# Altium schematic sheet aKaReZa75_eBoard_STM32F103C8__STM32F103C8__USBtoTTL.SchDoc: USBtoTTL
size A4; SheetNumber: 4; SheetTotal: 4
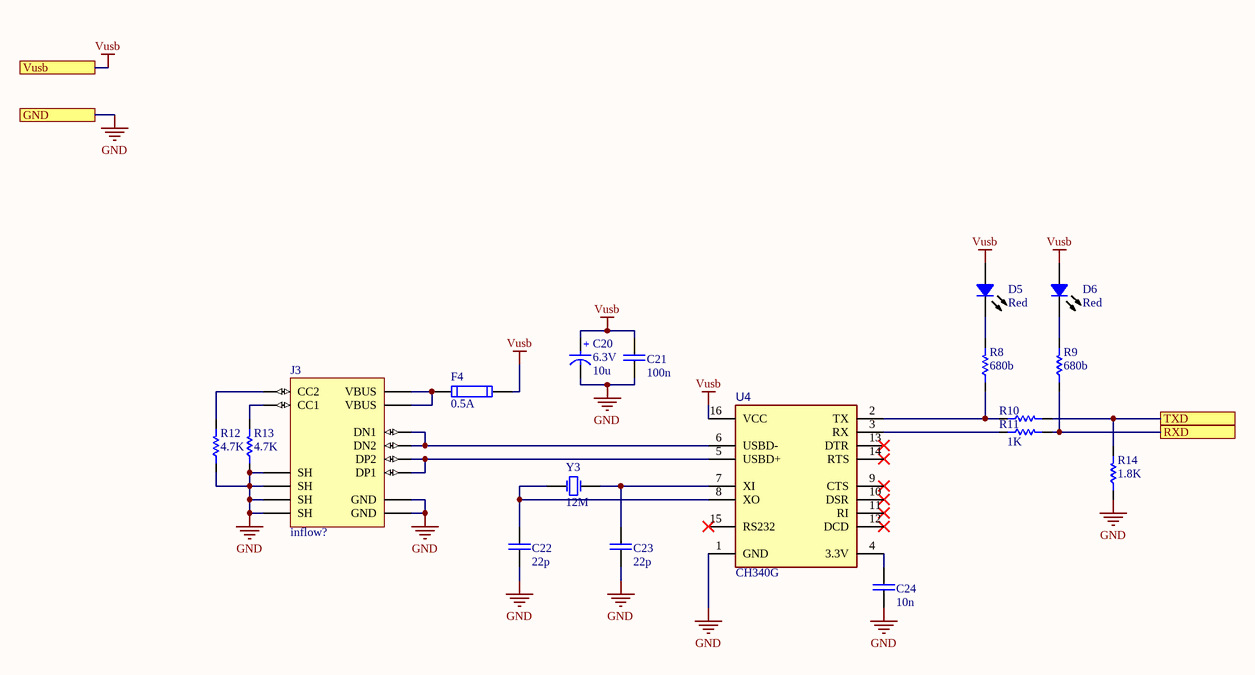
[diagram p0: aKaReZa75_eBoard_STM32F103C8__STM32F103C8__USBtoTTL.SchDoc]

## Parts
C20  Rating: 6.3V  [SMT_C_Tantalum_A]  (hidden comment: 10u)
C21  100n  [CAP 0805/2012]
C22  22p  [CAP 0805/2012]
C23  22p  [CAP 0805/2012]
C24  10n  [CAP 0805/2012]
D5  Red  [LED 0805/2012 RED]
D6  Red  [LED 0805/2012 RED]
F4  0.5A  [1206_F]
J3  Inflow: inflow?  [HRO_TYPE-C-31-M-12 - Extended]  (hidden comment: 12b)
R8  680b  [RES 0805 (2012X06L)]
R9  680b  [RES 0805 (2012X06L)]
R10  1K  [RES 0805 (2012X06L)]  (value not drawn)
R11  1K  [RES 0805 (2012X06L)]
R12  4.7K  [RES 0805 (2012X06L)]
R13  4.7K  [RES 0805 (2012X06L)]
R14  1.8K  [RES 0805 (2012X06L)]
U4  CH340G  [SO16_M]
Y3  12M  [Crystal SMD]

## Ports
GND, RXD, TXD, Vusb

## Nets
GND: C20.2(-) C21.2 C22.2 C23.2 C24.2 J3.A1_B12(GND) J3.B1_A12(GND) J3.S1(SH) J3.S2(SH) J3.S3(SH) J3.S4(SH) R12.1 R13.1 R14.1 U4.1(GND) ; port GND
Vusb: C20.1(+) C21.1 D5.1 D6.1 F4.2 U4.16(VCC) ; port Vusb
RXD: R9.1 R11.2 ; port RXD
TXD: R10.2 R14.2 ; port TXD
NetC22_1: C22.1 U4.8(XO) Y3.1(OSC1)
NetC23_1: C23.1 U4.7(XI) Y3.2(OSC2)
NetC24_1: C24.1 U4.4(3.3V)
NetD5_2: D5.2 R8.2
NetD6_2: D6.2 R9.2
NetF4_1: F4.1 J3.A4_B9(VBUS) J3.B4_A9(VBUS)
NetJ3_A5: J3.A5(CC1) R13.2
NetJ3_A6: J3.A6(DP1) J3.B6(DP2) U4.5(USBD+)
NetJ3_A7: J3.A7(DN1) J3.B7(DN2) U4.6(USBD-)
NetJ3_B5: J3.B5(CC2) R12.2
NetR8_1: R8.1 R10.1 U4.2(TX)
NetR11_1: R11.1 U4.3(RX)

Not connected (* = marked no-connect by the designer): U4 9(CTS)* 10(DSR)* 11(RI)* 12(DCD)* 13(DTR)* 14(RTS)* 15(RS232)*

## Notes on the sheet
- Title:
- Project:
- Drawn by:
- Revision:
- Hossein Bagheri
- Company:
- Sheet
- of

## Library data of the parts
C20 = Cap_Tantalum: Tantalum Capacitor,TAJ Series-SMD; Inflow: inflow?; Validation: Valid; Package: Package?; Type: Tantalum; Value: 10u
C21 = Cap_Multi_SMD_100nF_0805: Bipolar ceramic capacitor SMD; Inflow: inflow?; Type: MultiLayer; Rating: 50V; Validation: Valid; Package: 0805; Value: 100n
C22-C24 = Cap_Multi_SMD_0805: Bipolar ceramic capacitor SMD; Inflow: inflow?; Type: MultiLayer; Rating: Rating?; Validation: Valid; Package: 0805
  C22 C23: Value: 22p
  C24: Value: 10n
D5 D6 = Semi_LED_SMD: LED; Inflow: inflow?; Rating: Rating?; Validation: Valid; Package: Package?; Type: LED; Value: Red
F4 = Other_Elec_Fuse_SMD: Short circiut  protection; Inflow: inflow?; Type: Fast; Rating: Rating?; Validation: Valid; Package: 1206; Value: 0.5A
J3 = Con_USB_C: USB C Female Connector; Rating: Rating?; Validation: Valid; Value: 12b; Package: SMD; Type: C
R8-R14 = Res_SMD_0805: Resistor; Inflow: inflow?; Rating: 0.125W; Validation: Valid; Package: 0805; Type: 10%
  R8 R9: Value: 680b
  R10 R11: Value: 1K
  R12 R13: Value: 4.7K
  R14: Value: 1.8K
U4 = IC_Converter_CH340G: TTL To USB Chip; Rating: Rating?; Validation: Valid; Inflow: inflow?; Type: USB to TTL; Package: SO-16; Value: CH340G
Y3 = Other_Elec_Xtal_SMD: Crystal Oscillator; Rating: Rating?; Inflow: inflow?; Validation: Valid; Package: SMD; Type: Quartz; Value: 12M